# EAGLE design pro_event_light_a_mkI_base_board (EAGLE 7.7.0)

## Sheet 1 of 3: Spannungsversorgung
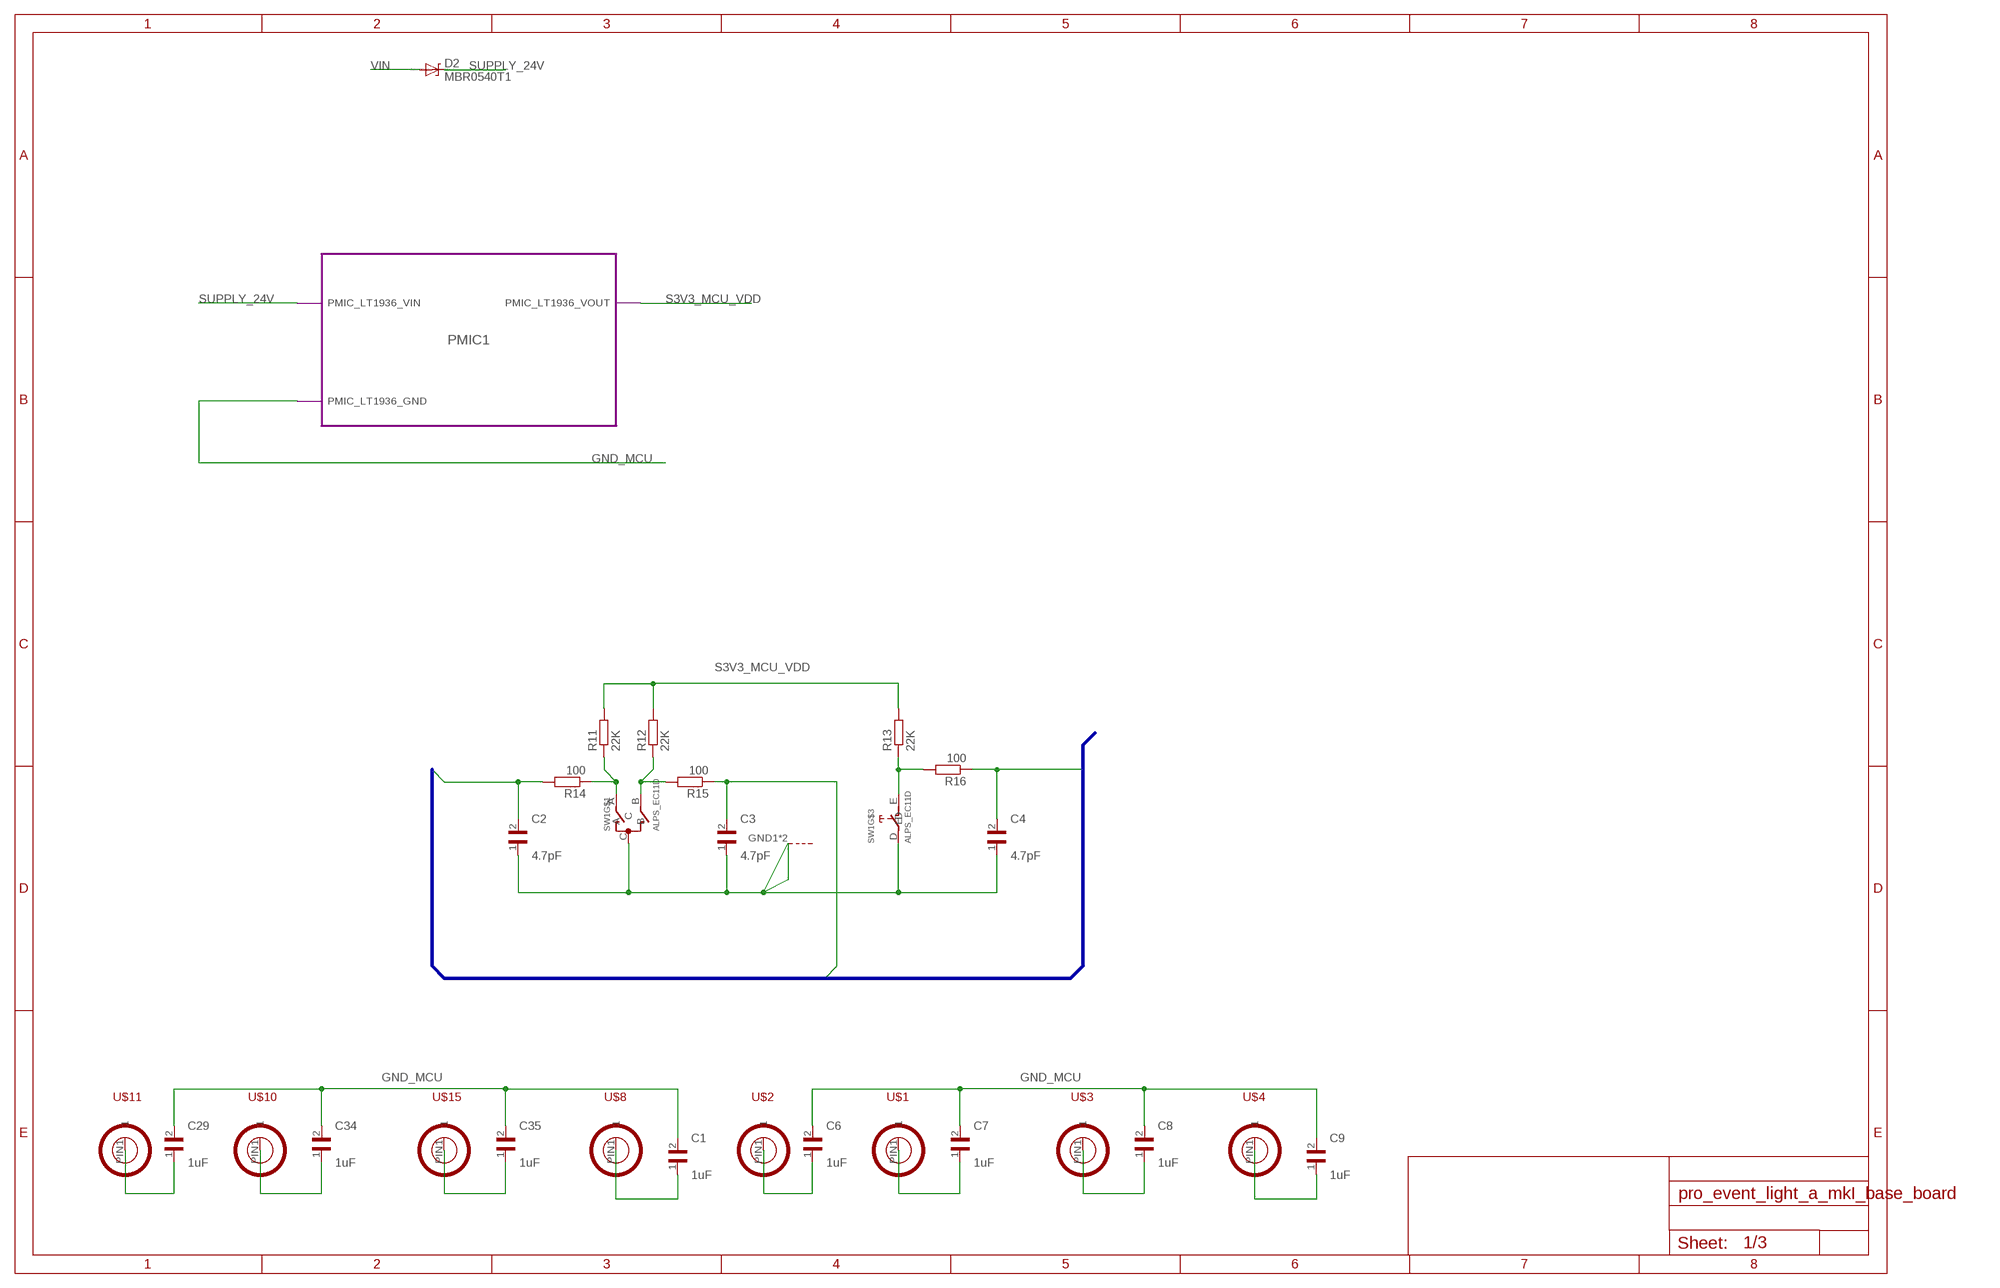
[diagram p0: schematic, sheet 1]

### Parts
C1  1uF  WCAP-CSGP_1206  [WCAP-CSGP_1206]
C2  4.7pF  WCAP-CSGP_0603-WAVE  [WCAP-CSGP_0603_WAVE]
C3  4.7pF  WCAP-CSGP_0603-WAVE  [WCAP-CSGP_0603_WAVE]
C4  4.7pF  WCAP-CSGP_0603-WAVE  [WCAP-CSGP_0603_WAVE]
C6  1uF  WCAP-CSGP_1206  [WCAP-CSGP_1206]
C7  1uF  WCAP-CSGP_1206  [WCAP-CSGP_1206]
C8  1uF  WCAP-CSGP_1206  [WCAP-CSGP_1206]
C9  1uF  WCAP-CSGP_1206  [WCAP-CSGP_1206]
C29  1uF  WCAP-CSGP_1206  [WCAP-CSGP_1206]
C34  1uF  WCAP-CSGP_1206  [WCAP-CSGP_1206]
C35  1uF  WCAP-CSGP_1206  [WCAP-CSGP_1206]
D2  MBR0540T1  [SOD123]
R11  22K  R-EU_R0603  [R0603]
R12  22K  R-EU_R0603  [R0603]
R13  22K  R-EU_R0603  [R0603]
R14  100  R-EU_R0603  [R0603]
R15  100  R-EU_R0603  [R0603]
R16  100  R-EU_R0603  [R0603]
SW1  ALPS_EC11D  [ALPS_EC11D]
U$1  PCB_MOUNTING_HOLES_M3  [PCB_MOUNTING_HOLES_M3]
U$2  PCB_MOUNTING_HOLES_M3  [PCB_MOUNTING_HOLES_M3]
U$3  PCB_MOUNTING_HOLES_M3  [PCB_MOUNTING_HOLES_M3]
U$4  PCB_MOUNTING_HOLES_M3  [PCB_MOUNTING_HOLES_M3]
U$8  PCB_MOUNTING_HOLES_M3  [PCB_MOUNTING_HOLES_M3]
U$10  PCB_MOUNTING_HOLES_M3  [PCB_MOUNTING_HOLES_M3]
U$11  PCB_MOUNTING_HOLES_M3  [PCB_MOUNTING_HOLES_M3]
U$15  PCB_MOUNTING_HOLES_M3  [PCB_MOUNTING_HOLES_M3]

### Module instances
PMIC1 = PMIC_LT1936

### Nets
ENCODER_A: C2.2 R14.2 ; also sheet 2
ENCODER_B: C3.2 R15.1 ; also sheet 2
ENCODER_D: C4.2 R16.1 ; also sheet 2
GND_MCU [MCU_Ground]: C1.2 C2.1 C3.1 C4.1 C6.2 C7.2 C8.2 C9.2 C29.2 C34.2 C35.2 SW1.C SW1.D SW1.GND1(G) SW1.GND2(G) ; port PMIC1.PMIC_LT1936_GND ; also sheet 2,3
N$1: R11.1 R14.1 SW1.A
N$2: R12.1 R15.2 SW1.B
N$5: C6.1 U$2.PIN1
N$8: C7.1 U$1.PIN1
N$9: C29.1 U$11.PIN1
N$10: C8.1 U$3.PIN1
N$11: C9.1 U$4.PIN1
N$15: C34.1 U$10.PIN1
N$16: R13.1 R16.2 SW1.E
N$17: C35.1 U$15.PIN1
N$18: C1.1 U$8.PIN1
S3V3_MCU_VDD: R11.2 R12.2 R13.2 ; port PMIC1.PMIC_LT1936_VOUT ; also sheet 2
SUPPLY_24V [MCU_Power]: D2.C ; port PMIC1.PMIC_LT1936_VIN ; also sheet 3
VIN: D2.A

### Buses
ENCODER_BUS:ENCODER_A,ENCODER_B,ENCODER_D

## Sheet 2 of 3: Mikrocontroller
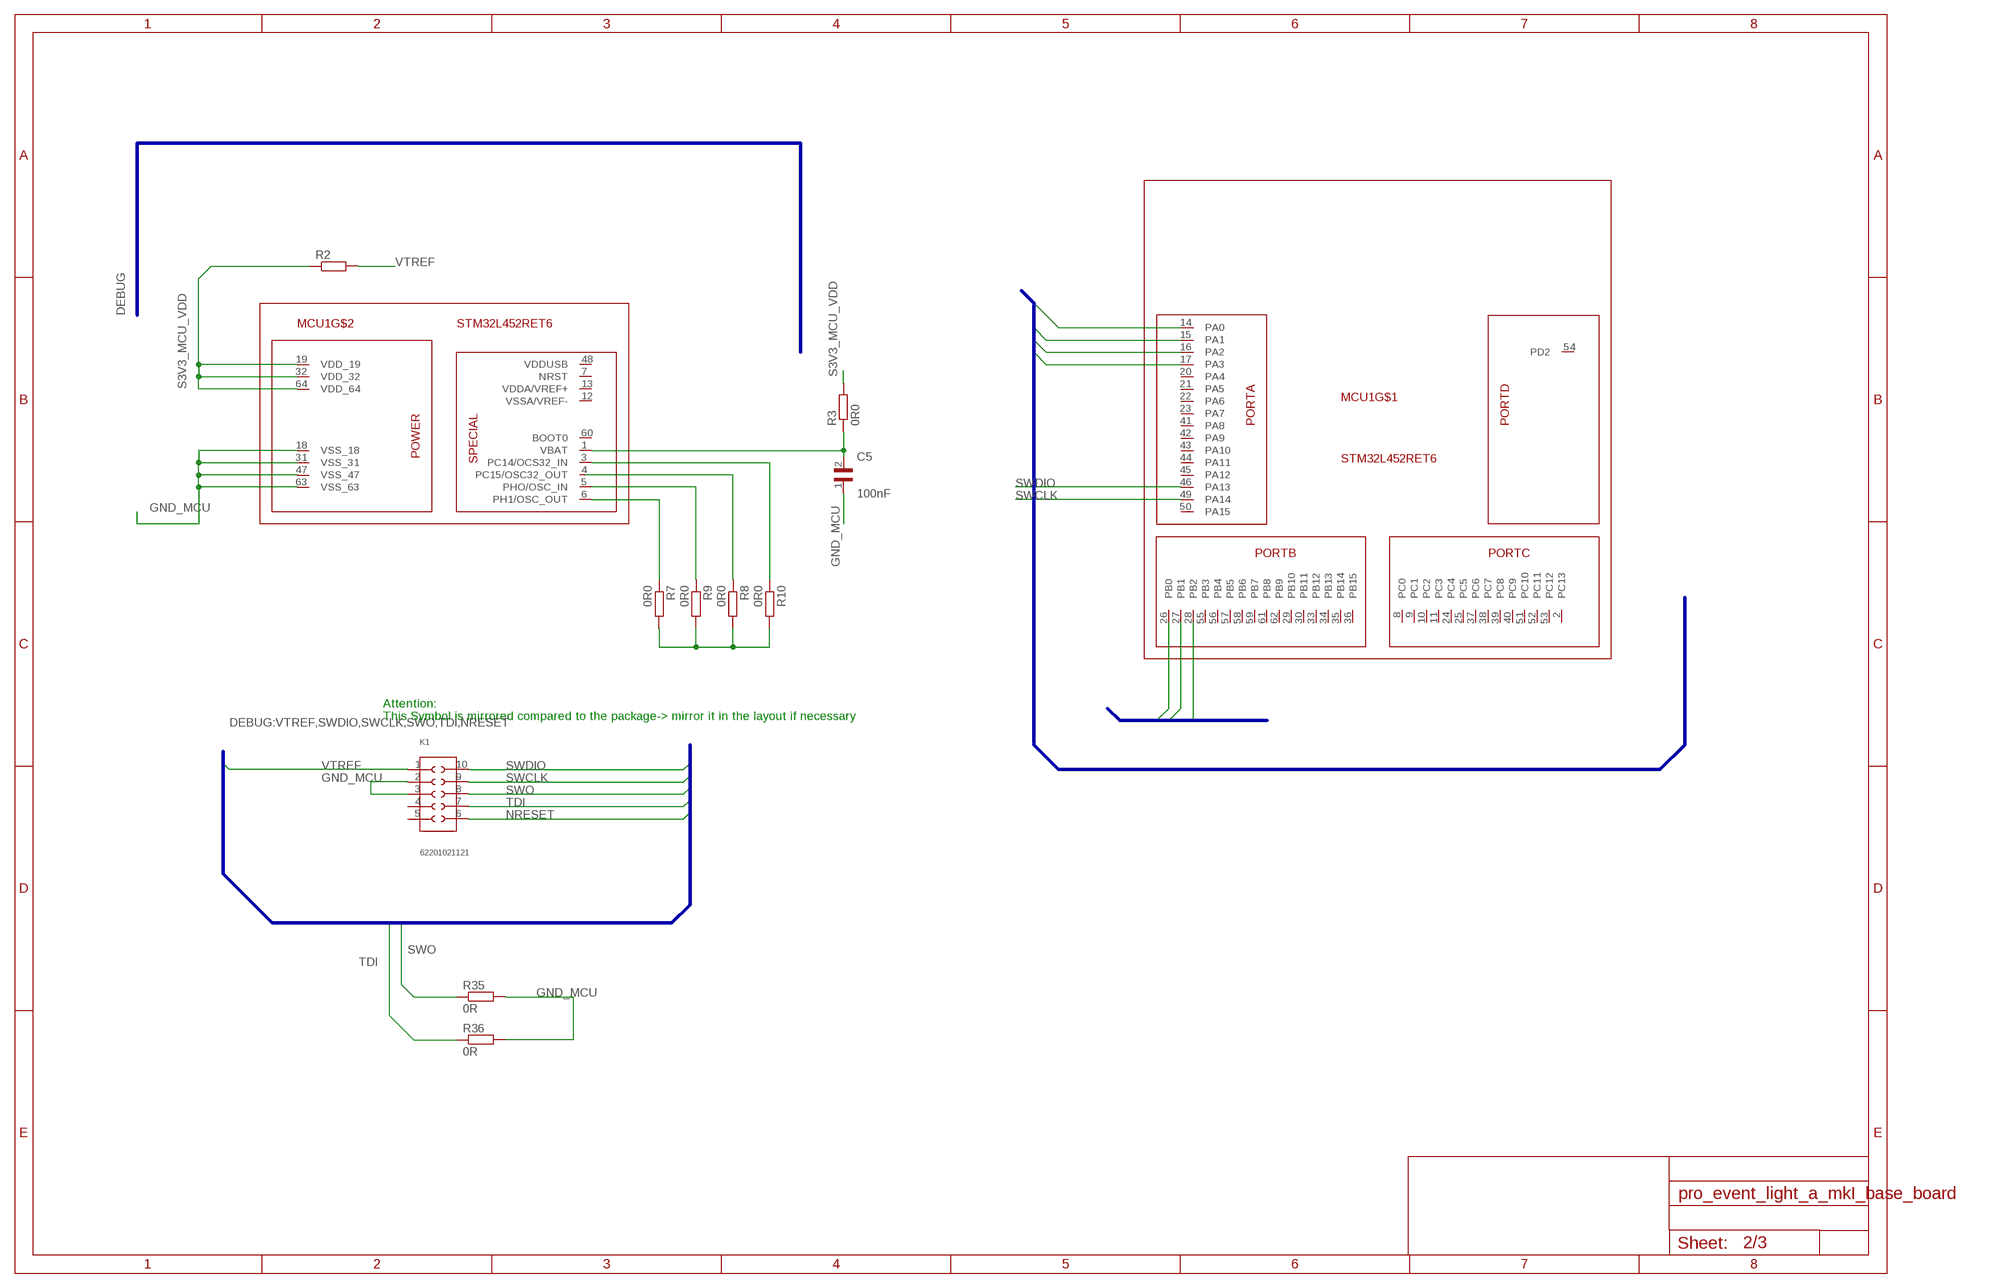
[diagram p1: schematic, sheet 2]

### Parts
C5  100nF  WCAP-CSGP_0603-REFLOW  [WCAP-CSGP_0603_REFLOW]
K1  62201021121  [62201021121]
MCU1  STM32L452RET6  [LQFP64]
R2  R-EU_R0603  [R0603]
R3  0R0  R-EU_R0603  [R0603]
R7  0R0  R-EU_R0603  [R0603]
R8  0R0  R-EU_R0603  [R0603]
R9  0R0  R-EU_R0603  [R0603]
R10  0R0  R-EU_R0603  [R0603]
R35  0R  R-EU_R0603  [R0603]
R36  0R  R-EU_R0603  [R0603]

### Nets
ENCODER_A: MCU1.26(PB0) ; also sheet 1
ENCODER_B: MCU1.27(PB1) ; also sheet 1
ENCODER_D: MCU1.28(PB2) ; also sheet 1
GND_MCU [MCU_Ground]: C5.1 K1.2 K1.3 MCU1.18(VSS_18) MCU1.47(VSS_47) MCU1.63(VSS_63) R7.2 R8.2 R9.2 R10.2 R35.2 R36.2 ; also sheet 1,3
LEDB: MCU1.15(PA1) ; also sheet 3
LEDG: MCU1.14(PA0) ; also sheet 3
LEDR: MCU1.16(PA2) ; also sheet 3
LEDW: MCU1.17(PA3) ; also sheet 3
N$19: C5.2 MCU1.1(VBAT) R3.1
N$20: MCU1.3(PC14/OCS32_IN) R10.1
N$21: R8.1
N$26: MCU1.5(PHO/OSC_IN) R9.1
N$27: MCU1.6(PH1/OSC_OUT) R7.1
NRESET [Debug]: K1.6
S3V3_MCU_VDD: MCU1.19(VDD_19) MCU1.32(VDD_32) MCU1.64(VDD_64) R2.1 R3.2 ; also sheet 1
SWCLK [Debug]: K1.9 MCU1.49(PA14)
SWDIO [Debug]: K1.10 MCU1.46(PA13)
SWO [Debug]: K1.8 R35.1
TDI [Debug]: K1.7 R36.1
VTREF [Debug]: K1.1 R2.2
Unconnected: K1.4 K1.5 MCU1.2(PC13) MCU1.4(PC15/OSC32_OUT) MCU1.7(NRST) MCU1.8(PC0) MCU1.9(PC1) MCU1.10(PC2) MCU1.11(PC3) MCU1.12(VSSA/VREF-) MCU1.13(VDDA/VREF+) MCU1.20(PA4) MCU1.21(PA5) MCU1.22(PA6) MCU1.23(PA7) MCU1.24(PC4) MCU1.25(PC5) MCU1.29(PB10) MCU1.30(PB11) MCU1.31(VSS_31) MCU1.33(PB12) MCU1.34(PB13) MCU1.35(PB14) MCU1.36(PB15) MCU1.37(PC6) MCU1.38(PC7) MCU1.39(PC8) MCU1.40(PC9) MCU1.41(PA8) MCU1.42(PA9) MCU1.43(PA10) MCU1.44(PA11) MCU1.45(PA12) MCU1.48(VDDUSB) MCU1.50(PA15) MCU1.51(PC10) MCU1.52(PC11) MCU1.53(PC12) MCU1.54(PD2) MCU1.55(PB3) MCU1.56(PB4) MCU1.57(PB5) MCU1.58(PB6) MCU1.59(PB7) MCU1.60(BOOT0) MCU1.61(PB8) MCU1.62(PB9)

### Buses
DEBUG:VTREF,SWDIO,SWCLK,SWO,TDI,NRESET
DEBUG
LEDBUS:LEDG,LEDB,LEDR,LEDW
ENCODER_BUS:ENCODER_A,ENCODER_B,ENCODER_D

### Notes on the sheet
- Attention:
  This Symbol is mirrored compared to the package-> mirror it in the layout if necessary

## Sheet 3 of 3: LED Power
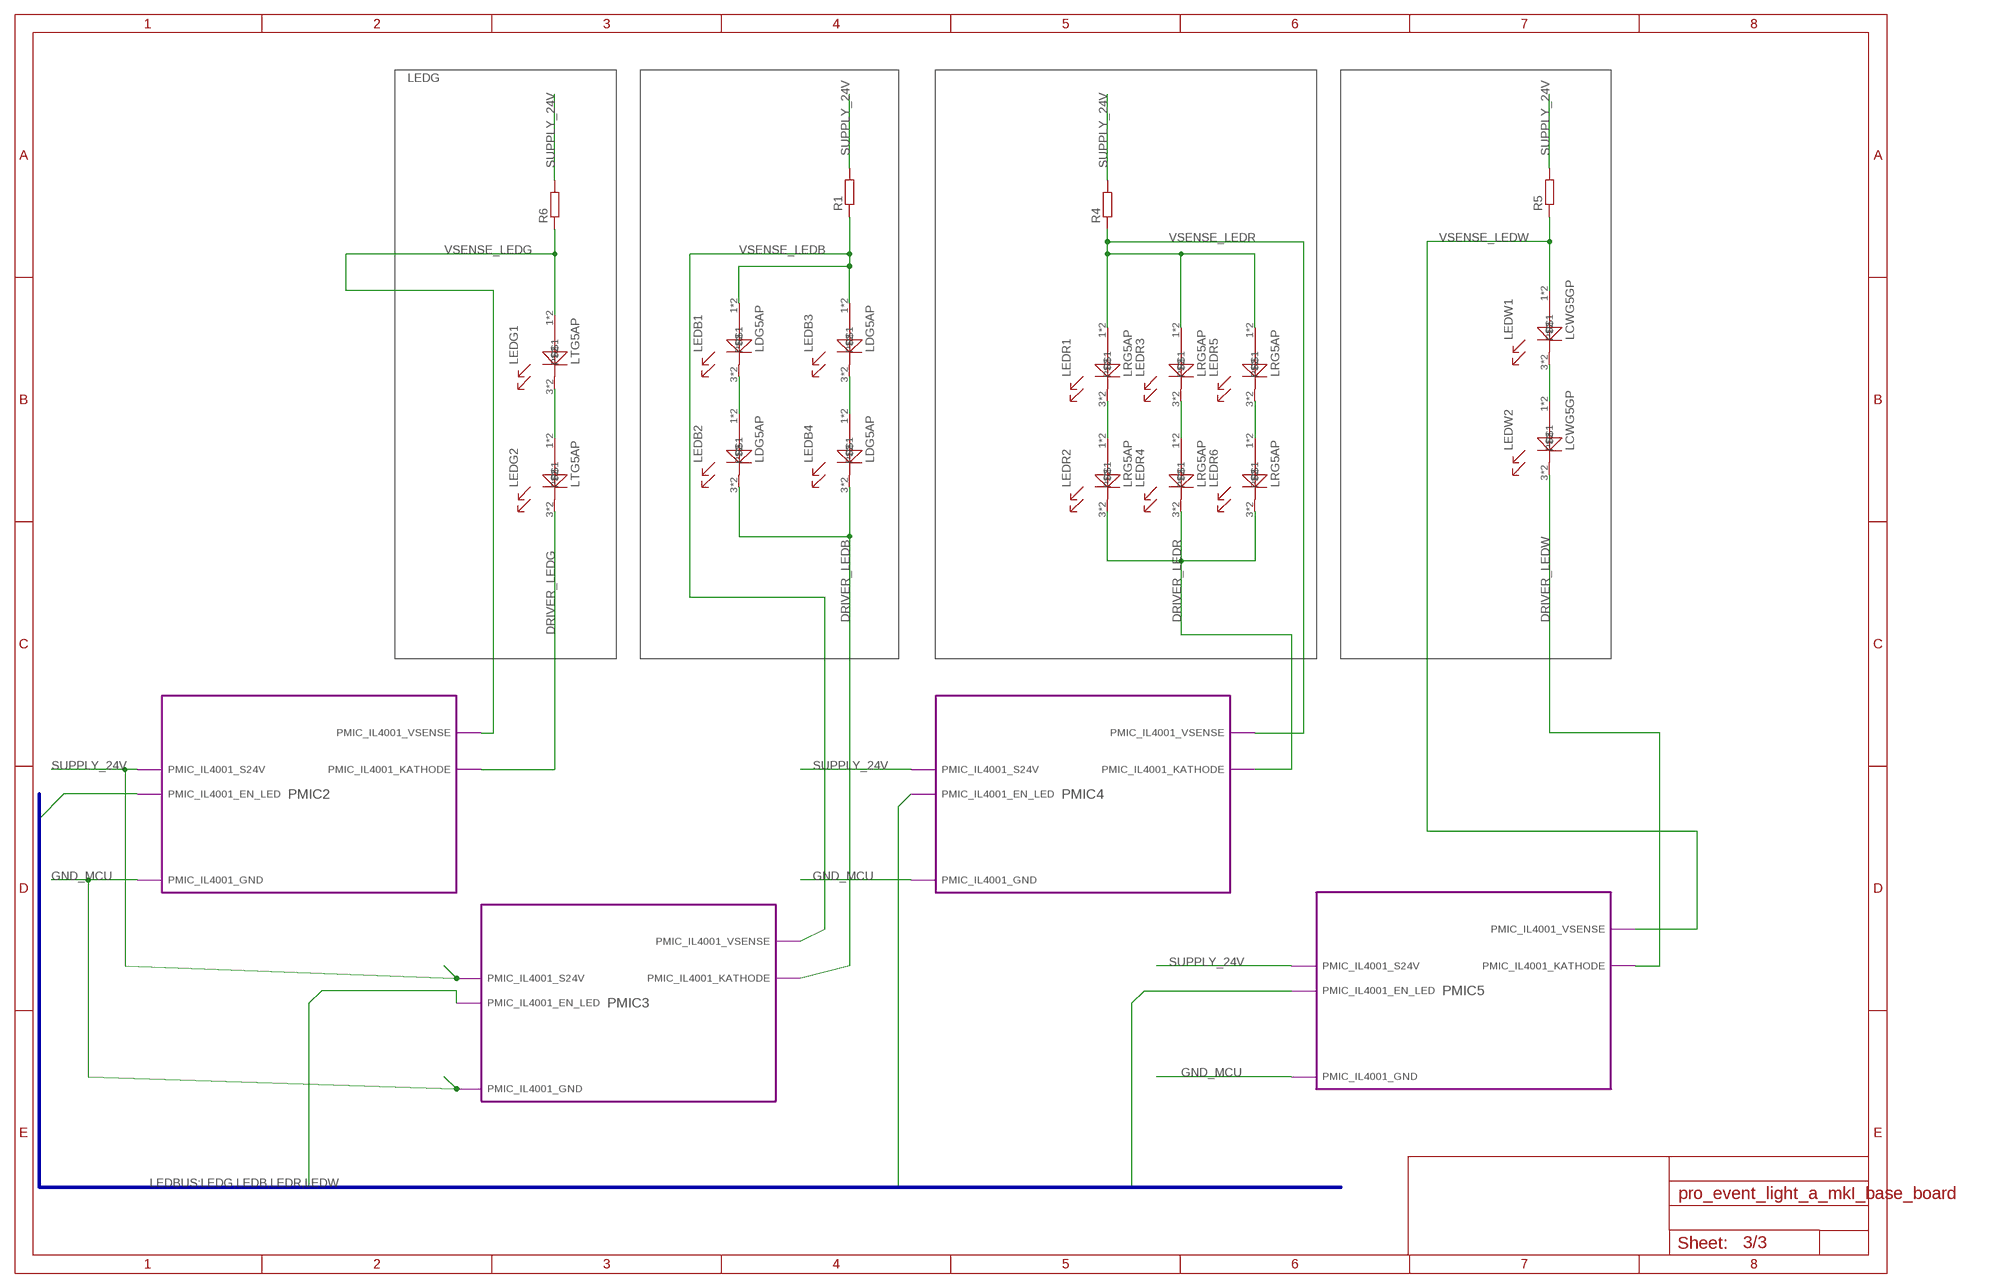
[diagram p2: schematic, sheet 3]

### Parts
LEDB1  LDG5AP  [P-LCC-2]
LEDB2  LDG5AP  [P-LCC-2]
LEDB3  LDG5AP  [P-LCC-2]
LEDB4  LDG5AP  [P-LCC-2]
LEDG1  LTG5AP  [P-LCC-2]
LEDG2  LTG5AP  [P-LCC-2]
LEDR1  LRG5AP  [P-LCC-2]
LEDR2  LRG5AP  [P-LCC-2]
LEDR3  LRG5AP  [P-LCC-2]
LEDR4  LRG5AP  [P-LCC-2]
LEDR5  LRG5AP  [P-LCC-2]
LEDR6  LRG5AP  [P-LCC-2]
LEDW1  LCWG5GP  [P-LCC-2]
LEDW2  LCWG5GP  [P-LCC-2]
R1  R-EU_R0603  [R0603]
R4  R-EU_R0603  [R0603]
R5  R-EU_R0603  [R0603]
R6  R-EU_R0603  [R0603]

### Module instances
PMIC2 = PMIC_IL4001
PMIC4 = PMIC_IL4001
PMIC5 = PMIC_IL4001
PMIC3 = PMIC_IL4001

### Nets
DRIVER_LEDB: LEDB2.3 LEDB2.4 LEDB4.3 LEDB4.4 ; port PMIC3.PMIC_IL4001_KATHODE
DRIVER_LEDG: LEDG2.3 LEDG2.4 ; port PMIC2.PMIC_IL4001_KATHODE
DRIVER_LEDR: LEDR2.3 LEDR2.4 LEDR4.3 LEDR4.4 LEDR6.3 LEDR6.4 ; port PMIC4.PMIC_IL4001_KATHODE
DRIVER_LEDW: LEDW2.3 LEDW2.4 ; port PMIC5.PMIC_IL4001_KATHODE
GND_MCU [MCU_Ground]: port PMIC2.PMIC_IL4001_GND PMIC3.PMIC_IL4001_GND PMIC5.PMIC_IL4001_GND PMIC4.PMIC_IL4001_GND ; also sheet 1,2
LEDB: port PMIC3.PMIC_IL4001_EN_LED ; also sheet 2
LEDG: port PMIC2.PMIC_IL4001_EN_LED ; also sheet 2
LEDR: port PMIC4.PMIC_IL4001_EN_LED ; also sheet 2
LEDW: port PMIC5.PMIC_IL4001_EN_LED ; also sheet 2
N$3: LEDG1.3 LEDG1.4 LEDG2.1 LEDG2.2
N$4: LEDB1.3 LEDB1.4 LEDB2.1 LEDB2.2
N$6: LEDB3.3 LEDB3.4 LEDB4.1 LEDB4.2
N$7: LEDR1.3 LEDR1.4 LEDR2.1 LEDR2.2
N$12: LEDR3.3 LEDR3.4 LEDR4.1 LEDR4.2
N$14: LEDR5.3 LEDR5.4 LEDR6.1 LEDR6.2
N$25: LEDW1.3 LEDW1.4 LEDW2.1 LEDW2.2
SUPPLY_24V [MCU_Power]: R1.2 R4.2 R5.2 R6.2 ; port PMIC2.PMIC_IL4001_S24V PMIC3.PMIC_IL4001_S24V PMIC5.PMIC_IL4001_S24V PMIC4.PMIC_IL4001_S24V ; also sheet 1
VSENSE_LEDB: LEDB1.1 LEDB1.2 LEDB3.1 LEDB3.2 R1.1 ; port PMIC3.PMIC_IL4001_VSENSE
VSENSE_LEDG: LEDG1.1 LEDG1.2 R6.1 ; port PMIC2.PMIC_IL4001_VSENSE
VSENSE_LEDR: LEDR1.1 LEDR1.2 LEDR3.1 LEDR3.2 LEDR5.1 LEDR5.2 R4.1 ; port PMIC4.PMIC_IL4001_VSENSE
VSENSE_LEDW: LEDW1.1 LEDW1.2 R5.1 ; port PMIC5.PMIC_IL4001_VSENSE

### Buses
LEDBUS:LEDG,LEDB,LEDR,LEDW

### Notes on the sheet
- LEDG

## Library data of the parts
C1-C9 C29 C34 C35 = Eagle_Wurth_Elektronik_Passive_Capacitors_rev15a:WCAP-CSGP: WCAP-CSGP Ceramic Capacitors Characteristics Multilayer Ceramic Chip Capacitor Recommended soldering:Reflow, for 0603 and 0805 wave soldering is also allowed Operating temperature:-55 °C to +125 °C; Ceramic characteristics: Class I - NPO ; Class II -X7R, X5R High performance ceramic High capacitance stability Minimal aging Termination:Cu/Ni/Sn <http://katalog.we-online.de/media/images/eisos/WCAP-CSGP_pf2.jpg> Details see: http://katalog.we-online.de/en/pbs/WCAP-CSGP/?m Created: 2015-01-28 2015 (C) Wurth Elektronik
D2 = mod_eagle_library_discrete_elements:MBR0540T1: MBR0540T1
K1 = Board_to_Board_Connectors_rev15d:62201021121: WR-PHD 1.27mm Dual Pin Header, 10 Pins=>Code : Con_BTB_PHD_1.27_2_62201021121 <http://katalog.we-online.de/media/thumbs2/eican/thb_Con_BTB_PHD_1.27_2_6220xx21121_pf2.jpg> Details see: http://katalog.we-online.de/en/em/622_0xx_211_21 Created 2014-06-03, Karrer Zheng 2014 (C) Würth Elektronik
LEDB1-LEDB4 = mod_eagle_library_discrete_elements:LDG5AP: OSRAM Advanced Power TOPLED LDG5AP deep blue
LEDG1 LEDG2 = mod_eagle_library_discrete_elements:LTG5AP: OSRAM Advanced Power TOPLED LTG5AP true green
LEDR1-LEDR6 = mod_eagle_library_discrete_elements:LRG5AP: OSRAM Advanced Power TOPLED LRG5AP single color red
LEDW1 LEDW2 = mod_eagle_library_discrete_elements:LCWG5GP: OSRAM Advanced Power TOPLED LCWG5GP warm white
MCU1 = mod_eagle_library_MCU_CPU:STM32L452RET6: STM32L452RET6
R1-R16 R35 R36 = rcl:R-EU_: RESISTOR, European symbol
SW1 = mod_eagle_library_switches:ALPS_EC11D: ALPS EC11D rotary switch
U$1-U$4 U$8 U$10 U$11 U$15 = mod-eagle_library_standard_passive_parts:PCB_MOUNTING_HOLES_M3

## Module PMIC_IL4001
Ports: PMIC_IL4001_S24V(io) PMIC_IL4001_EN_LED(io) PMIC_IL4001_GND(io) PMIC_IL4001_KATHODE(io) PMIC_IL4001_VSENSE(io)
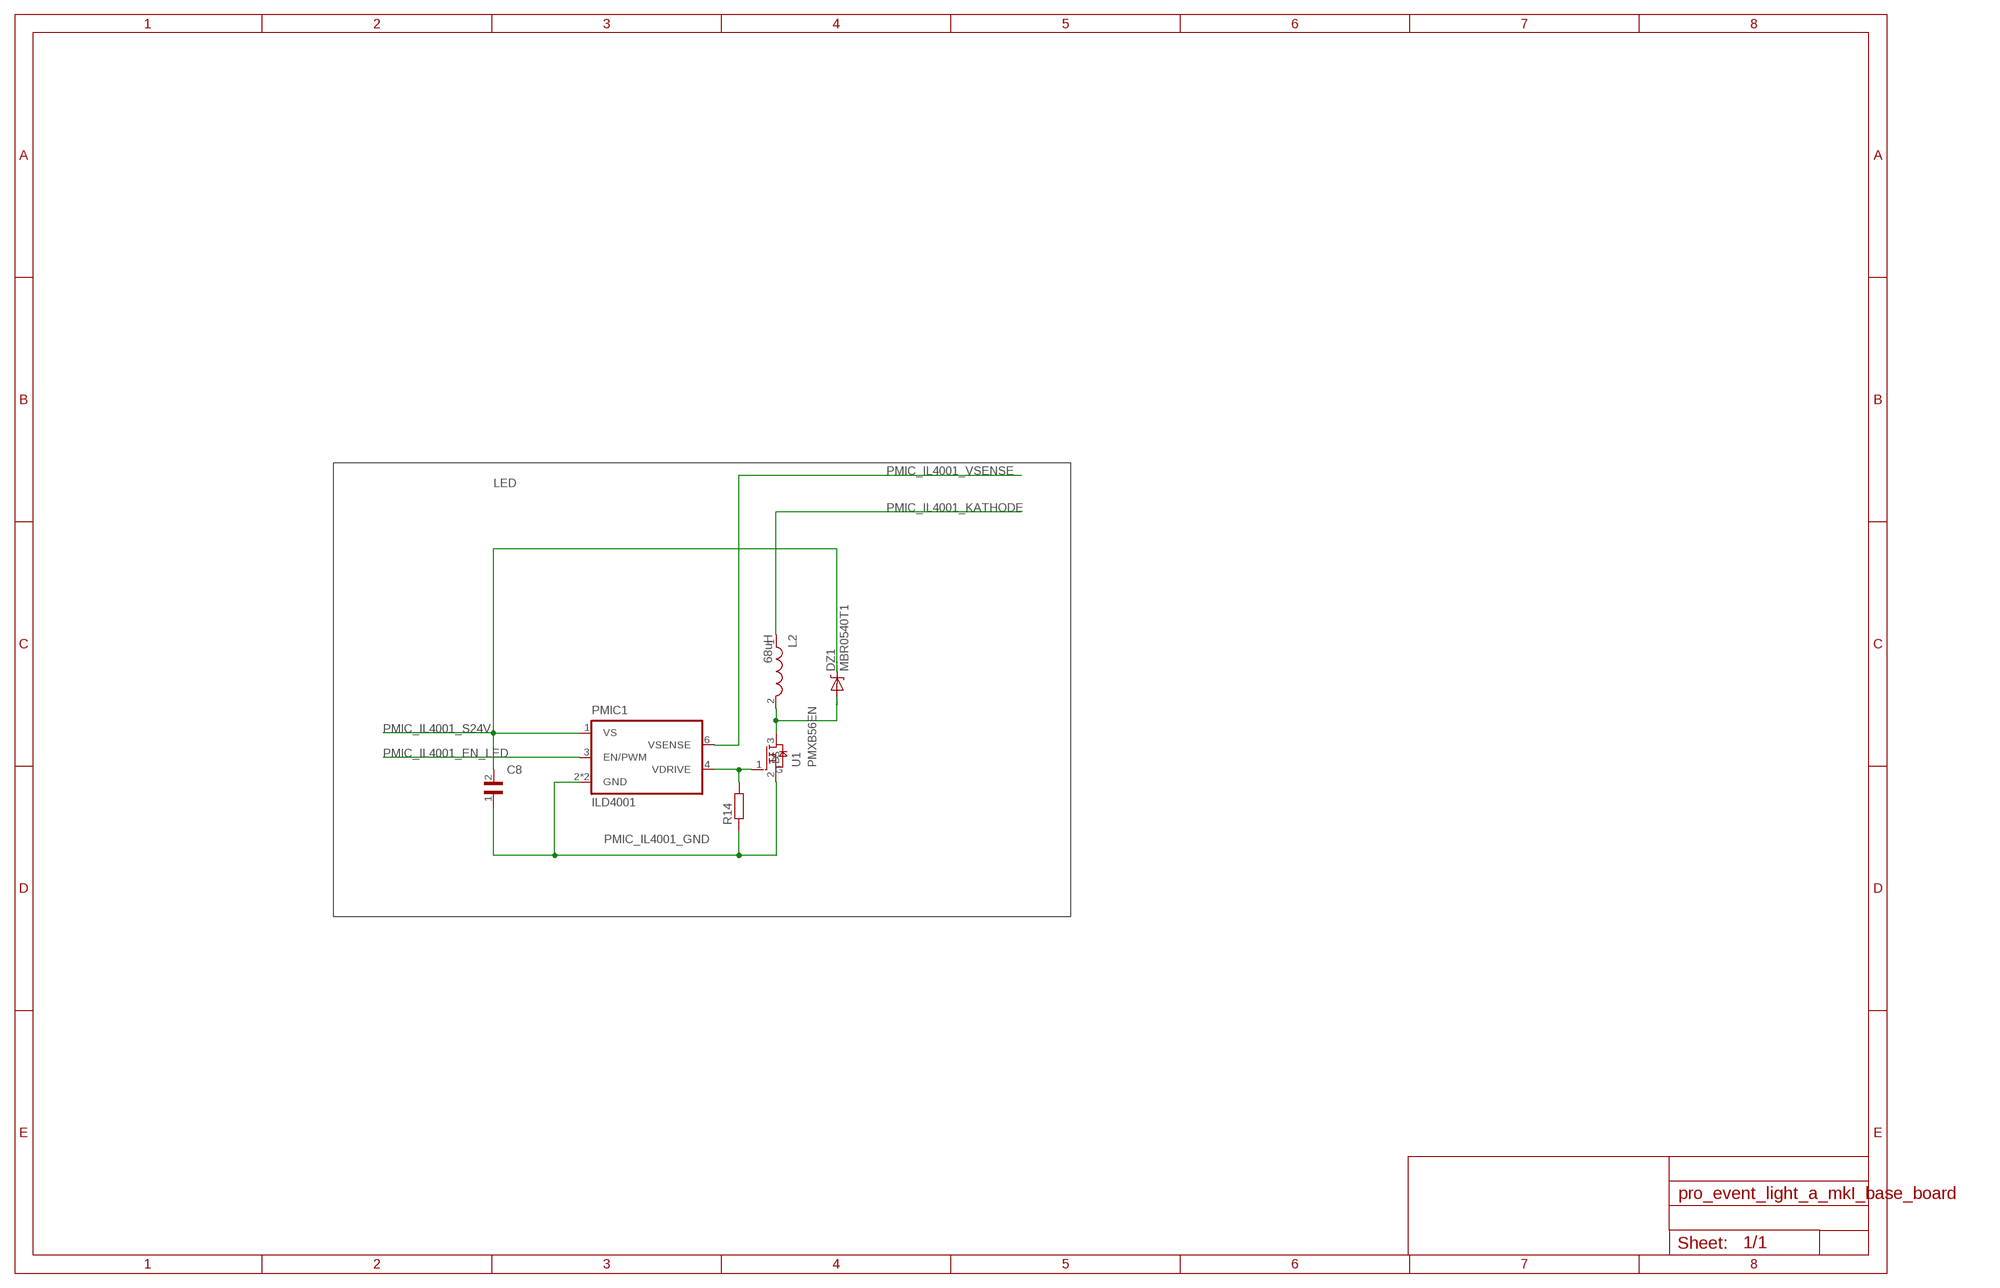
[diagram p3: schematic, module PMIC_IL4001, sheet 1]

### Parts
C8  WCAP-CSGP_0603-WAVE  [WCAP-CSGP_0603_WAVE]
DZ1  MBR0540T1  [SOD123]
L2  68uH  WE-LQ_1210  [WE-LQ_M]
PMIC1  ILD4001  [SC74_INFINEON]
R14  R-EU_R0603  [R0603]
U1  PMXB56EN  [DFN1010D-3]

### Nets
N$2: PMIC1.4(VDRIVE) R14.2 U1.1(G)
N$29: DZ1.A L2.2 U1.3(D)
PMIC_IL4001_EN_LED: PMIC1.3(EN/PWM)
PMIC_IL4001_GND [MCU_Ground]: C8.1 PMIC1.2(GND) PMIC1.5(GND) R14.1 U1.2(S)
PMIC_IL4001_KATHODE: L2.1
PMIC_IL4001_S24V: C8.2 DZ1.C PMIC1.1(VS)
PMIC_IL4001_VSENSE: PMIC1.6(VSENSE)

### Notes on the sheet
- LED

### Library data of the parts
C8 = Eagle_Wurth_Elektronik_Passive_Capacitors_rev15a:WCAP-CSGP: WCAP-CSGP Ceramic Capacitors Characteristics Multilayer Ceramic Chip Capacitor Recommended soldering:Reflow, for 0603 and 0805 wave soldering is also allowed Operating temperature:-55 °C to +125 °C; Ceramic characteristics: Class I - NPO ; Class II -X7R, X5R High performance ceramic High capacitance stability Minimal aging Termination:Cu/Ni/Sn <http://katalog.we-online.de/media/images/eisos/WCAP-CSGP_pf2.jpg> Details see: http://katalog.we-online.de/en/pbs/WCAP-CSGP/?m Created: 2015-01-28 2015 (C) Wurth Elektronik
DZ1 = mod_eagle_library_discrete_elements:MBR0540T1: MBR0540T1
L2 = EagleLibrary_Wuerth_Elektronik_eiSos_rev16a:WE-LQ: SMD Inductor Characteristics Miniature chip inductor wound on a special ferrite core Small inductances for compact circuits High Q at high frequencies Low DC-resistance Operating temperature: –40 ºC to +125 ºC Applications Low power DC/DC-converters from Linear Technology, National Semiconductor, Texas Instruments, Fairchild Semiconductor, ON Semiconductor, STMicroelectronics, Maxim, MPS, Semtech, Exar, Analogic Tech, Diodes and Cologne Chip EMI-Filtering RF-circuits <http://katalog.we-online.de/media/images/eisos/IndLQ_pf2.jpg> Details see: http://katalog.we-online.de/en/pbs/WE-LQ? Updated by Dan Xu 2014-07-08 2014 (C) Wurth Elektronik
PMIC1 = infineon:ILD4001: LED Driver for High Power LEDs Source: http://www.infineon.com/dgdl/ILD4001-Step-down-LED-Controller-Rev2.0.pdf?folderId=db3a30431f848401011fcbf2ab4c04c4&fileId=db3a30433072cd8f01308fc1af03786b
R14 = rcl:R-EU_: RESISTOR, European symbol
U1 = mod_eagle_library_discrete_elements:PMXB56EN

## Module PMIC_LT1936
Ports: PMIC_LT1936_VIN(io) PMIC_LT1936_VOUT(io) PMIC_LT1936_GND(io)
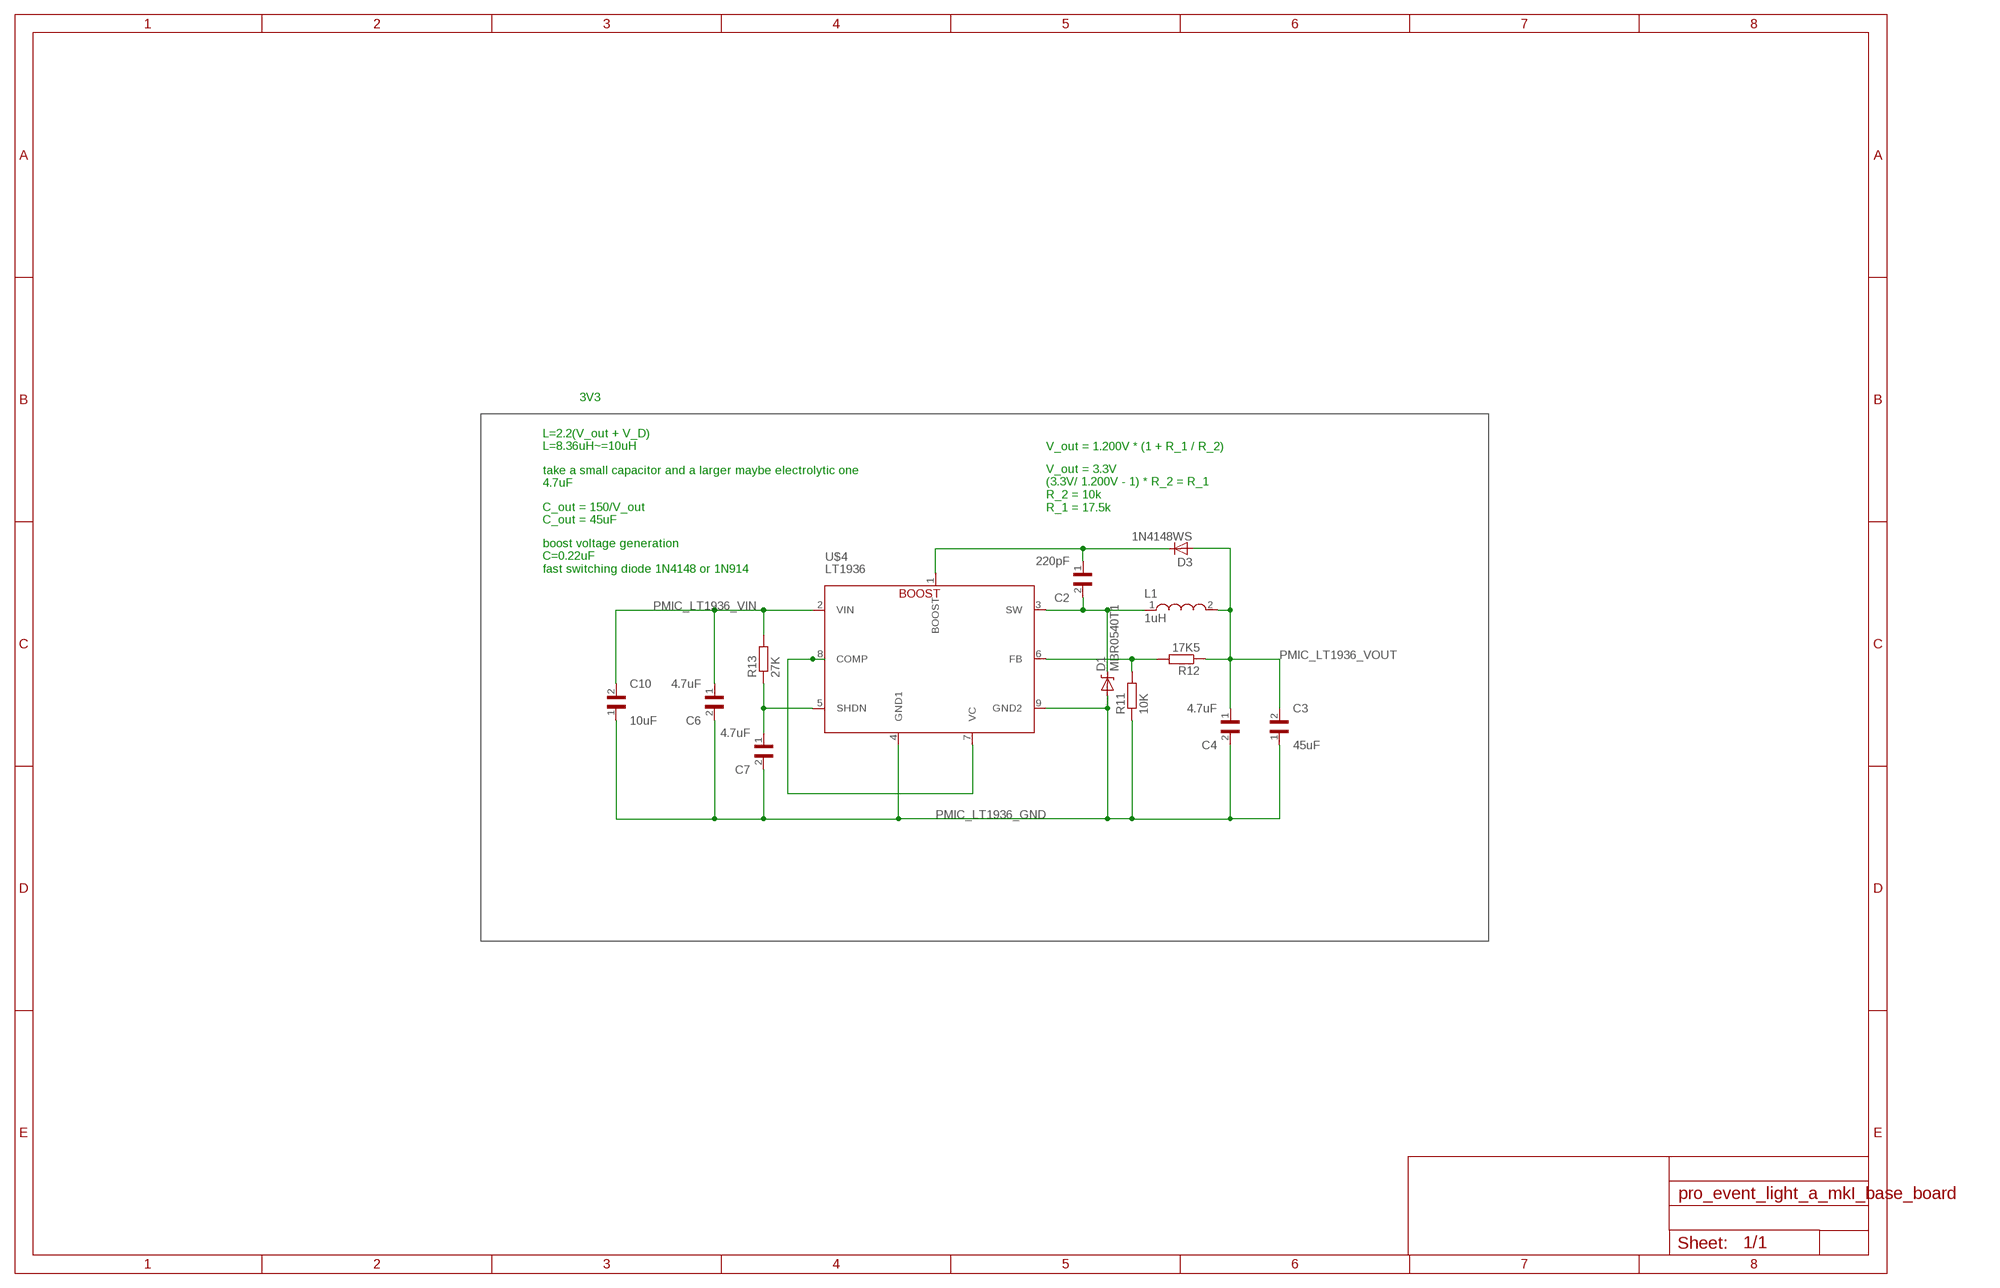
[diagram p4: schematic, module PMIC_LT1936, sheet 1]

### Parts
C2  220pF  WCAP-CSGP_0603-WAVE  [WCAP-CSGP_0603_WAVE]
C3  45uF  WCAP-ASNP_4X5.5(DXL)  [2.6X1.6X1(BXCXA)]
C4  4.7uF  WCAP-CSGP_0603-WAVE  [WCAP-CSGP_0603_WAVE]
C6  4.7uF  WCAP-CSGP_0603-WAVE  [WCAP-CSGP_0603_WAVE]
C7  4.7uF  WCAP-CSGP_0603-WAVE  [WCAP-CSGP_0603_WAVE]
C10  10uF  WCAP-ASNP_4X5.5(DXL)  [2.6X1.6X1(BXCXA)]
D1  MBR0540T1  [SOD123]
D3  1N4148WS  [SOD323]
L1  1uH  WE-LQ_1210  [WE-LQ_M]
R11  10K  R-EU_R0603  [R0603]
R12  17K5  R-EU_R0603  [R0603]
R13  27K  R-EU_R0603  [R0603]
U$4  LT1936  [MSOP8]

### Nets
N$28: U$4.7(VC) U$4.8(COMP)
N$30: C7.1 R13.1 U$4.5(SHDN)
N$35: R11.2 R12.2 U$4.6(FB)
PMIC_LT1936_BOOST: C2.1 D3.C U$4.1(BOOST)
PMIC_LT1936_GND [MCU_Ground]: C3.1 C4.2 C6.2 C7.2 C10.1 D1.A R11.1 U$4.4(GND1) U$4.9(GND2)
PMIC_LT1936_SW: C2.2 D1.C L1.1 U$4.3(SW)
PMIC_LT1936_VIN: C6.1 C10.2 R13.2 U$4.2(VIN)
PMIC_LT1936_VOUT: C3.2 C4.1 D3.A L1.2 R12.1

### Notes on the sheet
- 3V3
- L=2.2(V_out + V_D)
  L=8.36uH~=10uH
- V_out = 1.200V * (1 + R_1 / R_2)
- take a small capacitor and a larger maybe electrolytic one
  4.7uF
- V_out = 3.3V
  (3.3V/ 1.200V - 1) * R_2 = R_1
  R_2 = 10k
  R_1 = 17.5k
- C_out = 150/V_out
  C_out = 45uF
- boost voltage generation
  C=0.22uF
  fast switching diode 1N4148 or 1N914

### Library data of the parts
C2 C4 C6 C7 = Eagle_Wurth_Elektronik_Passive_Capacitors_rev15a:WCAP-CSGP: WCAP-CSGP Ceramic Capacitors Characteristics Multilayer Ceramic Chip Capacitor Recommended soldering:Reflow, for 0603 and 0805 wave soldering is also allowed Operating temperature:-55 °C to +125 °C; Ceramic characteristics: Class I - NPO ; Class II -X7R, X5R High performance ceramic High capacitance stability Minimal aging Termination:Cu/Ni/Sn <http://katalog.we-online.de/media/images/eisos/WCAP-CSGP_pf2.jpg> Details see: http://katalog.we-online.de/en/pbs/WCAP-CSGP/?m Created: 2015-01-28 2015 (C) Wurth Elektronik
C3 C10 = Eagle_Wurth_Elektronik_Passive_Capacitors_rev15a:WCAP-ASNP: WCAP-ASNP Aluminum Electrolytic Capacitors Characteristics Aluminum Electrolytic Capacitor Recommended soldering: Reflow Operating temperature: -40 °C to +85 °C Non-polarized product series with +85 °C max temperature Load life:2000 h @ +85 °C Package name and Variant abbreviation: Package: Package: B X C X A = length of the solder pad X width of the solder pad X pitch of the solder pad. Variant: D X L = Diameter of the body part X Height of the body part. <http://katalog.we-online.de/media/images/eisos/WCAP-ASNP_pf2.jpg> Details see: http://katalog.we-online.de/en/pbs/WCAP-ASNP?m Created: 2015-03-10 2015 (C) Wurth Elektronik
D1 = mod_eagle_library_discrete_elements:MBR0540T1: MBR0540T1
D3 = mod_eagle_library_discrete_elements:1N4148WS: 1N4148WS <https://www.vishay.com/diodes/list/product-85413>
L1 = EagleLibrary_Wuerth_Elektronik_eiSos_rev16a:WE-LQ: SMD Inductor Characteristics Miniature chip inductor wound on a special ferrite core Small inductances for compact circuits High Q at high frequencies Low DC-resistance Operating temperature: –40 ºC to +125 ºC Applications Low power DC/DC-converters from Linear Technology, National Semiconductor, Texas Instruments, Fairchild Semiconductor, ON Semiconductor, STMicroelectronics, Maxim, MPS, Semtech, Exar, Analogic Tech, Diodes and Cologne Chip EMI-Filtering RF-circuits <http://katalog.we-online.de/media/images/eisos/IndLQ_pf2.jpg> Details see: http://katalog.we-online.de/en/pbs/WE-LQ? Updated by Dan Xu 2014-07-08 2014 (C) Wurth Elektronik
R11-R13 = rcl:R-EU_: RESISTOR, European symbol
U$4 = mod_eagle_library_pmic:LT1936

## Net classes
4 MCU_Power: width 0.203 mm, clearance 0.152 mm to class 0, clearance 0.152 mm to class 1, clearance 0.152 mm to class 2, clearance 0.152 mm to class 3, clearance 0.152 mm
5 Debug: width 0.152 mm, drill 0.305 mm, clearance 0.152 mm to class 0, clearance 0.152 mm to class 1, clearance 0.152 mm to class 2, clearance 0.152 mm to class 3, clearance 0.152 mm to class 4, clearance 0.152 mm
8 MCU_Ground: width 0.203 mm, drill 0.203 mm, clearance 0.152 mm to class 0, clearance 0.152 mm to class 1, clearance 0.152 mm to class 2, clearance 0.152 mm to class 3, clearance 0.152 mm to class 4, clearance 0.152 mm to class 5, clearance 0.152 mm to class 6, clearance 0.152 mm to class 7, clearance 0.152 mm

## Board
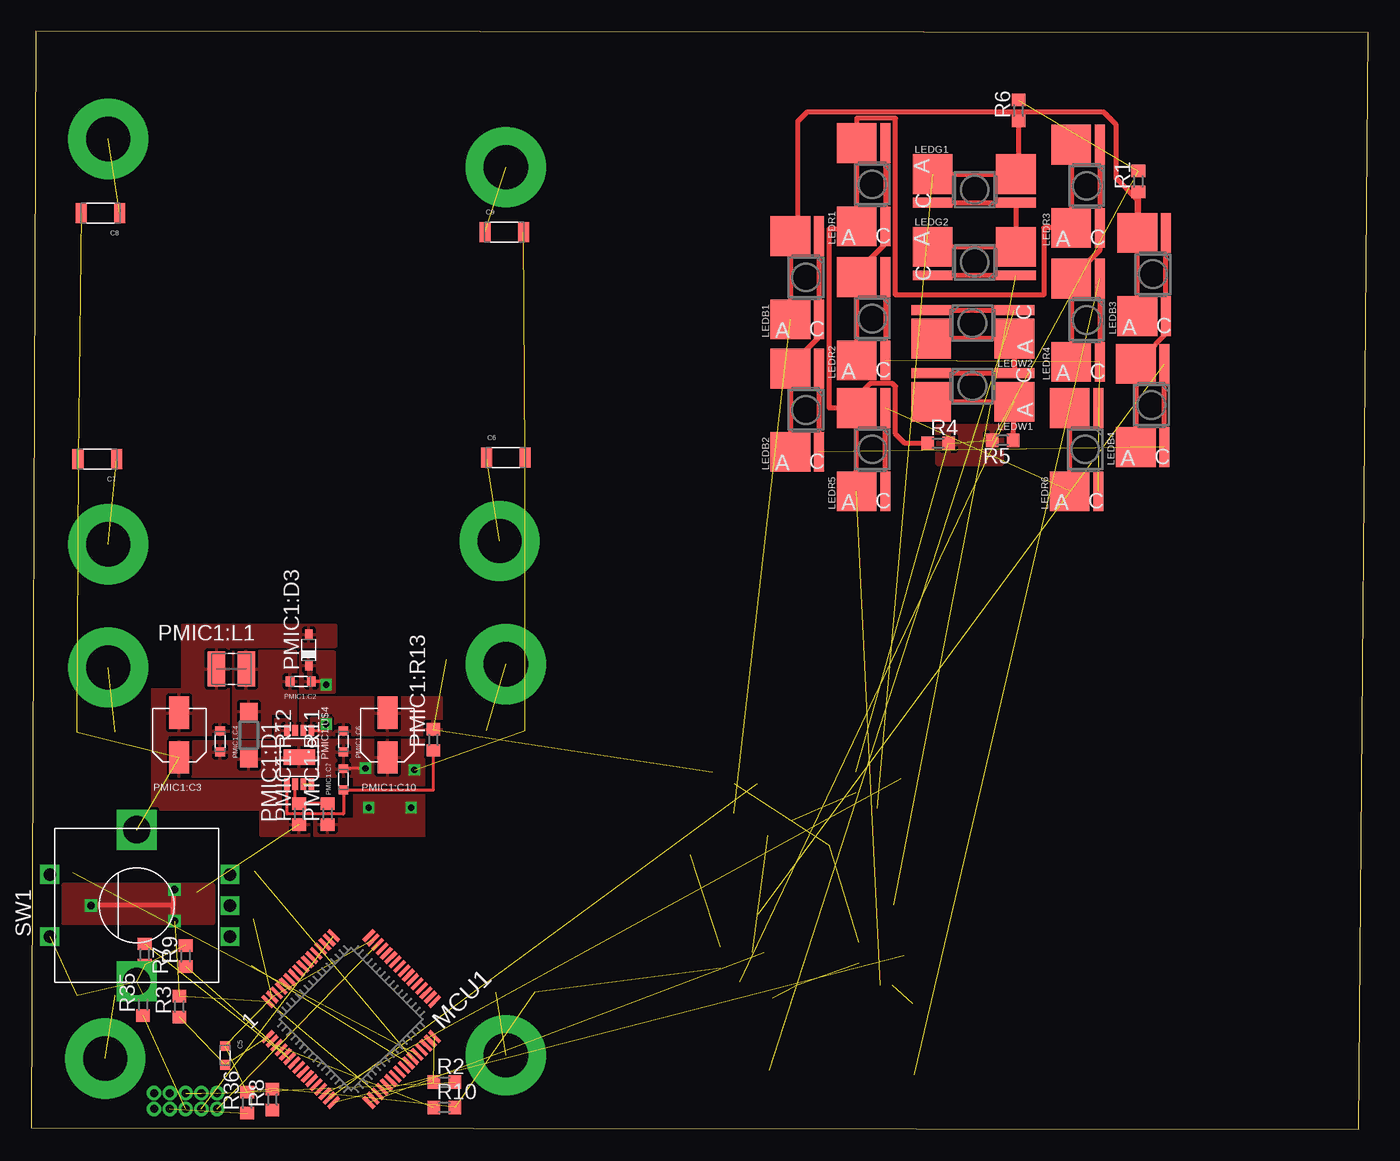
[diagram p5: board, top side]
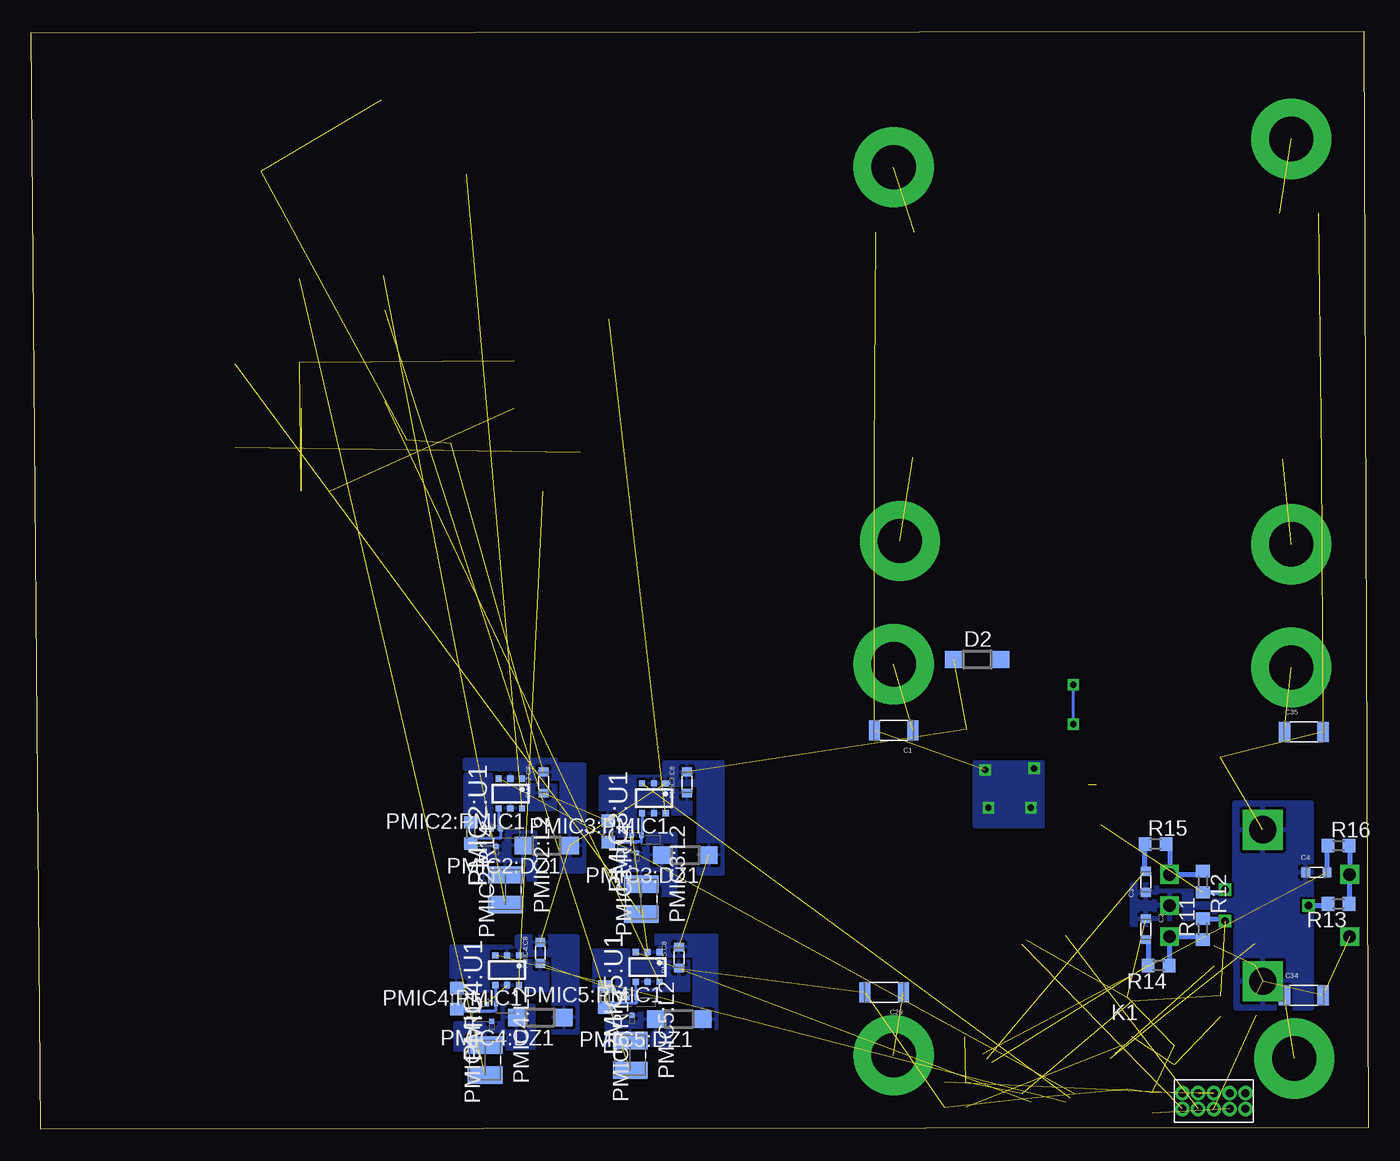
[diagram p6: board, bottom side, seen from below]

Size 107.68 x 88.44 mm. Coordinates in mm from the lower left corner, seen from the top.
Outline: 0,0.13 106.91,0 107.68,88.32 0.38,88.44 0,0.13
Copper layers (1*16): Top 0.035mm / dielectric 1.5mm / Bottom 0.035mm
Design rules "default": minimum track width 10mil, minimum drill 24mil, track to track 8mil, track to pad 8mil, pad to pad 8mil, via to via 8mil, smd to smd 8mil, copper to edge 40mil, drill to drill 8mil, minimum pad ring 10mil, minimum via ring 8mil, stop-mask expansion 4mil, vias tented up to drill 0mil, thermal gap 10mil

### Footprints (pad centres in the part's own frame; a part is rotated, then mirrored left to right if it is on the bottom)
WCAP-CSGP_1206 = smd 0.9 x 1.6: 1 -1.55,0; 2 1.55,0
WCAP-CSGP_0603_WAVE = smd 0.7 x 0.8: 1 -0.85,0; 2 0.85,0
WCAP-CSGP_0603_REFLOW = smd 0.8 x 0.8: 1 -0.75,0; 2 0.75,0
SOD123 = smd 1.4 x 1.4: A 1.9,0; C -1.9,0
62201021121 = drill 0.65: 1 -2.54,0.635; 2 -1.27,0.635; 3 0,0.635; 4 1.27,0.635; 5 2.54,0.635; 6 2.54,-0.635; 7 1.27,-0.635; 8 0,-0.635; 9 -1.27,-0.635; 10 -2.54,-0.635
P-LCC-2 = smd 3.2 x 3.2: 1 -3.35,1.6; 2 3.35,1.6 | smd 3.2 x 0.8: 3 -3.35,-0.7; 4 3.35,-0.7
LQFP64 = smd 1.2 x 0.3: 1 -5.75,3.75; 2 -5.75,3.25; 3 -5.75,2.75; 4 -5.75,2.25; 5 -5.75,1.75; 6 -5.75,1.25; 7 -5.75,0.75; 8 -5.75,0.25; 9 -5.75,-0.25; 10 -5.75,-0.75; 11 -5.75,-1.25; 12 -5.75,-1.75; 13 -5.75,-2.25; 14 -5.75,-2.75; 15 -5.75,-3.25; 16 -5.75,-3.75; 33 5.75,-3.75; 34 5.75,-3.25; 35 5.75,-2.75; 36 5.75,-2.25; 37 5.75,-1.75; 38 5.75,-1.25; 39 5.75,-0.75; 40 5.75,-0.25; 41 5.75,0.25; 42 5.75,0.75; 43 5.75,1.25; 44 5.75,1.75; 45 5.75,2.25; 46 5.75,2.75; 47 5.75,3.25; 48 5.75,3.75 | smd 0.3 x 1.2: 17 -3.75,-5.75; 18 -3.25,-5.75; 19 -2.75,-5.75; 20 -2.25,-5.75; 21 -1.75,-5.75; 22 -1.25,-5.75; 23 -0.75,-5.75; 24 -0.25,-5.75; 25 0.25,-5.75; 26 0.75,-5.75; 27 1.25,-5.75; 28 1.75,-5.75; 29 2.25,-5.75; 30 2.75,-5.75; 31 3.25,-5.75; 32 3.75,-5.75; 49 3.75,5.75; 50 3.25,5.75; 51 2.75,5.75; 52 2.25,5.75; 53 1.75,5.75; 54 1.25,5.75; 55 0.75,5.75; 56 0.25,5.75; 57 -0.25,5.75; 58 -0.75,5.75; 59 -1.25,5.75; 60 -1.75,5.75; 61 -2.25,5.75; 62 -2.75,5.75; 63 -3.25,5.75; 64 -3.75,5.75
2.6X1.6X1(BXCXA) = smd 2.6 x 1.6: 1 1.8,0; 2 -1.8,0
SOD323 = smd 0.8 x 0.6: A 1.25,0; C -1.25,0
WE-LQ_M = smd 1.4 x 2.8: 1 -1.2,0; 2 1.2,0
R0603 = smd 1 x 1.1: 1 -0.85,0; 2 0.85,0
MSOP8 = smd 0.45 x 0.9: 1 -0.975,-2.171; 2 -0.325,-2.171; 3 0.325,-2.171; 4 0.975,-2.171; 5 0.975,2.171; 6 0.325,2.171; 7 -0.325,2.171; 8 -0.975,2.171 | smd 2.54 x 1.27: 9 0,0
SC74_INFINEON = smd 0.5 x 0.5: 1 -0.95,-1.2; 2 0,-1.2; 3 0.95,-1.2; 4 0.95,1.2; 5 0,1.2; 6 -0.95,1.2
DFN1010D-3 = smd 0.35 x 0.4: 1 0.375,0.7; 2 -0.375,0.7 | smd 0.4 x 0.4: 3 0,-0.7
ALPS_EC11D = drill 1 square: A -2.5,-7.5; B 2.5,-7.5; C 0,-7.5; D -2.5,7; E 2.5,7 | drill 2.2 square: GND1 -6.1,0; GND2 6.1,0
PCB_MOUNTING_HOLES_M3 = drill 3.556 pad 6.452: PIN1 0,0

### Placement (x,y rotation side)
C1  38.23,32.13 180 bottom
C2  17.91,16.13 270 bottom
C3  17.91,19.94 90 bottom
C4  4.19,20.7 0 bottom
C5  15.62,5.97 270 top
C6  38.23,54.1 0 top
C7  5.33,53.98 180 top
C8  5.59,73.79 180 top
C9  38.1,72.26 0 top
C29  38.99,11.05 180 bottom
C34  5.21,10.79 0 bottom
C35  5.21,32 0 bottom
D2  31.5,37.85 0 bottom
K1  12.45,2.29 0 bottom
LEDB1  62.74,68.58 90 top
LEDB2  62.74,57.91 90 top
LEDB3  90.68,68.83 90 top
LEDB4  90.55,58.29 90 top
LEDG1  75.95,75.31 0 top
LEDG2  75.95,69.47 0 top
LEDR1  68.07,76.07 90 top
LEDR2  68.07,65.28 90 top
LEDR3  85.34,75.95 90 top
LEDR4  85.34,65.15 90 top
LEDR5  68.07,54.74 90 top
LEDR6  85.22,54.74 90 top
LEDW1  75.82,60.2 180 top
LEDW2  75.82,65.28 180 top
MCU1  25.78,8.89 45 top
PMIC1:C2  220pF  [WCAP-CSGP_0603_WAVE]  21.72,36.07 180 top
PMIC1:C3  45uF  [2.6X1.6X1(BXCXA)]  11.94,31.75 270 top
PMIC1:C4  4.7uF  [WCAP-CSGP_0603_WAVE]  15.24,31.24 270 top
PMIC1:C6  4.7uF  [WCAP-CSGP_0603_WAVE]  25.15,31.24 270 top
PMIC1:C7  4.7uF  [WCAP-CSGP_0603_WAVE]  25.15,28.19 90 top
PMIC1:C10  10uF  [2.6X1.6X1(BXCXA)]  28.7,31.75 270 top
PMIC1:D1  MBR0540T1  [SOD123]  17.53,31.75 270 top
PMIC1:D3  1N4148WS  [SOD323]  22.35,38.61 90 top
PMIC1:L1  1uH  [WE-LQ_M]  16.13,37.08 180 top
PMIC1:R11  10K  [R0603]  23.88,25.4 90 top
PMIC1:R12  17K5  [R0603]  21.59,25.4 90 top
PMIC1:R13  27K  [R0603]  32.38,31.37 90 top
PMIC1:U$4  LT1936  [MSOP8]  21.59,29.97 180 top
PMIC2:C8  [WCAP-CSGP_0603_WAVE]  66.42,27.94 90 bottom
PMIC2:DZ1  MBR0540T1  [SOD123]  66.17,22.86 180 bottom
PMIC2:L2  68uH  [WE-LQ_M]  69.47,19.3 90 bottom
PMIC2:PMIC1  ILD4001  [SC74_INFINEON]  69.09,27.05 180 bottom
PMIC2:R14  [R0603]  72.26,23.88 270 bottom
PMIC2:U1  PMXB56EN  [DFN1010D-3]  70.23,23.49 0 bottom
PMIC3:C8  [WCAP-CSGP_0603_WAVE]  54.86,27.94 90 bottom
PMIC3:DZ1  MBR0540T1  [SOD123]  54.99,22.1 180 bottom
PMIC3:L2  68uH  [WE-LQ_M]  58.55,18.54 90 bottom
PMIC3:PMIC1  ILD4001  [SC74_INFINEON]  57.53,26.67 180 bottom
PMIC3:R14  [R0603]  61.21,24 270 bottom
PMIC3:U1  PMXB56EN  [DFN1010D-3]  58.93,22.99 0 bottom
PMIC4:C8  [WCAP-CSGP_0603_WAVE]  66.67,14.22 90 bottom
PMIC4:DZ1  MBR0540T1  [SOD123]  66.67,9.02 180 bottom
PMIC4:L2  68uH  [WE-LQ_M]  71.12,5.59 90 bottom
PMIC4:PMIC1  ILD4001  [SC74_INFINEON]  69.34,12.83 180 bottom
PMIC4:R14  [R0603]  73.41,10.54 270 bottom
PMIC4:U1  PMXB56EN  [DFN1010D-3]  70.61,9.4 0 bottom
PMIC5:C8  [WCAP-CSGP_0603_WAVE]  55.5,13.84 90 bottom
PMIC5:DZ1  MBR0540T1  [SOD123]  55.5,8.89 180 bottom
PMIC5:L2  68uH  [WE-LQ_M]  59.44,5.97 90 bottom
PMIC5:PMIC1  ILD4001  [SC74_INFINEON]  58.04,13.08 180 bottom
PMIC5:R14  [R0603]  61.47,10.67 270 bottom
PMIC5:U1  PMXB56EN  [DFN1010D-3]  59.31,9.91 0 bottom
R1  89.15,76.33 90 top
R2  33.27,3.81 0 top
R3  11.94,9.91 90 top
R4  73.03,55.25 0 top
R5  78.23,55.5 180 top
R6  79.5,82.04 90 top
R7  9.14,14.1 270 top
R8  19.43,2.41 90 top
R9  12.45,13.97 90 top
R10  33.27,1.78 0 top
R11  13.34,16.13 90 bottom
R12  13.34,19.94 270 bottom
R13  2.41,18.16 180 bottom
R14  16.89,13.21 180 bottom
R15  17.14,22.99 0 bottom
R16  2.41,22.86 0 bottom
R35  9.02,10.03 90 top
R36  17.4,2.16 90 top
SW1  8.51,18.03 90 top
U$1  6.22,47.12 0 top
U$2  37.72,47.37 0 top
U$3  6.22,79.76 0 top
U$4  38.23,77.47 0 top
U$8  38.23,37.47 0 top
U$10  5.97,5.71 0 top
U$11  38.23,5.97 0 top
U$15  6.22,37.21 0 top

### Tracks (layer width: path | path; a pad name or v marks a point on that pad's centre or on a via)
DRIVER_LEDB  (2 unrouted)
  Top 0.406: LEDB4.3 LEDB4.4 | LEDB2.4 LEDB2.3
DRIVER_LEDG  (1 unrouted)
  Top 0.406: LEDG2.4 LEDG2.3
DRIVER_LEDR  (4 unrouted)
  Top 0.406: LEDR4.4 LEDR4.3 | LEDR2.4 LEDR2.3
DRIVER_LEDW  (1 unrouted)
  Top 0.406: LEDW2.4 LEDW2.3
ENCODER_A  (1 unrouted)
  Bottom 0.406: C2.2 17.74,15.28 R14.2
ENCODER_B  (1 unrouted)
  Bottom 0.406: C3.2 18,20.79 R15.1
ENCODER_D  (1 unrouted)
  Bottom 0.406: R16.1 3.34,22.86 C4.2
GND_MCU  (via drill 0.5)  (28 unrouted)
  Top 0.254: 26.42,29.08 25.15,29.08 PMIC1:C7.2
  other vias: 27.18,25.91 30.61,25.91 30.86,28.96 26.92,29.08
  pour Top: 11.3,31.24 19.68,31.24 19.68,33.02 20.7,33.02 20.7,31.37 31.62,31.37 31.62,28.45 11.3,28.45
  pour Top: 22.86,25.02 26.04,25.02 26.04,28.7 31.62,28.7 31.62,23.62 22.86,23.62
  pour Bottom: 26.16,29.59 31.75,29.59 31.75,24.38 26.16,24.38
  pour Bottom: 65.41,27.69 68.71,27.81 68.71,28.57 72.77,28.57 72.77,24.13 70.48,24.13 70.48,25.78 65.41,25.78
  pour Bottom: 54.48,27.3 57.02,27.3 57.02,28.45 61.85,28.45 61.85,23.62 58.93,23.62 58.93,25.4 54.48,25.4
  pour Bottom: 66.04,13.59 68.96,13.59 68.96,14.73 73.91,14.73 73.91,11.18 66.04,11.18
  pour Bottom: 54.74,11.18 62.36,11.18 62.36,14.48 57.66,14.48 57.66,13.59 54.74,13.59
  pour Bottom: 19.05,19.68 19.05,16.51 17.14,16.51 17.14,17.02 10.67,17.02 10.67,9.78 4.57,9.78 4.57,26.29 10.79,26.29 10.79,19.18 17.02,19.18 17.02,19.68
LEDB  (1 unrouted)
LEDG  (1 unrouted)
LEDR  (1 unrouted)
LEDW  (1 unrouted)
N$1
  Bottom 0.406: R14.1 16.04,15.53 SW1.A 13.59,15.53 R11.1
N$2
  Bottom 0.406: R15.2 16.01,22.99 SW1.B 13.46,20.53 R12.1
N$3
  Top 0.406: LEDG1.3 LEDG1.4 LEDG2.2 LEDG2.1
N$4
  Top 0.406: LEDB1.4 LEDB1.3 63.44,63.82 61.98,62.36 61.98,62.1 LEDB2.2 LEDB2.1
N$5  (1 unrouted)
N$6
  Top 0.406: LEDB3.4 LEDB3.3 91.38,64.07 89.66,62.36 89.66,62.35 LEDB4.2 LEDB4.1
N$7
  Top 0.406: LEDR1.4 LEDR1.3 68.77,71.31 66.8,69.34 66.8,68.96 LEDR2.2 LEDR2.1
N$8  (1 unrouted)
N$9  (1 unrouted)
N$10  (1 unrouted)
N$11  (1 unrouted)
N$12
  Top 0.406: LEDR3.4 LEDR3.3 86.04,70.8 LEDR4.2 LEDR4.1
N$14  (1 unrouted)
  Top 0.406: LEDR6.1 LEDR6.2 | LEDR5.3 LEDR5.4
N$15  (1 unrouted)
N$16
  Bottom 0.406: R16.2 1.51,22.86 SW1.E 1.51,18.29 R13.1
N$17  (1 unrouted)
N$18  (1 unrouted)
N$19  (2 unrouted)
N$20  (1 unrouted)
N$25
  Top 0.406: LEDW2.2 LEDW2.1 LEDW1.3 LEDW1.4
N$26  (1 unrouted)
N$27  (1 unrouted)
PMIC1:N$28  (1 unrouted)
PMIC1:N$30
  Top 0.254: PMIC1:U$4.5 20.61,25.4 25.15,25.4 PMIC1:C7.1 25.15,27.3 32.38,27.3 PMIC1:R13.1
PMIC1:N$35
  Top 0.254: PMIC1:R11.2 PMIC1:R12.2 21.27,26.25 PMIC1:U$4.6
PMIC1:PMIC_LT1936_BOOST  (via drill 0.5)
  Top 0.254: PMIC1:U$4.1 23.5,32.14 v23.75,32.64 | v23.75,35.81 23.5,36.07 PMIC1:C2.1
  Bottom 0.254: v23.75,32.64 v23.75,35.81
  pour Top: 21.72,38.48 24.38,38.48 24.38,35.18 21.72,35.18
  pour Top: 22.61,31.75 22.61,33.15 24.13,33.15 24.13,31.75
PMIC1:PMIC_LT1936_SW
  pour Top: 21.34,32 21.34,38.48 16.26,38.48 16.26,31.62 19.3,31.62 19.3,33.53 21.08,33.53 21.08,32
PMIC2:N$2
  Bottom 0.254: PMIC2:PMIC1.4 70.04,24.2 PMIC2:U1.1 69.85,23.49 72.26,23.49 PMIC2:R14.2
PMIC2:N$29
  pour Bottom: 67.06,24 67.06,20.07 71.25,20.07 71.25,23.11 69.47,23.11 69.47,24
PMIC3:N$2
  Bottom 0.254: PMIC3:PMIC1.4 58.48,23.69 PMIC3:U1.1 58.55,23.15 PMIC3:R14.2
PMIC3:N$29
  pour Bottom: 55.75,23.88 55.75,18.8 60.2,18.8 60.2,22.73 58.04,22.73 58.04,23.88
PMIC4:N$2
  Bottom 0.254: PMIC4:R14.2 72.9,9.69 72.9,9.53 70.29,9.53 70.29,10.1 | PMIC4:PMIC1.4 70.29,10.1 | 70.29,10.1 PMIC4:U1.1
PMIC4:N$29
  pour Bottom: 67.18,10.03 67.18,6.48 73.53,6.35 73.53,8.64 69.72,8.64 69.72,10.03
PMIC5:N$2
  Bottom 0.254: PMIC5:PMIC1.4 58.99,10.61 PMIC5:U1.1 58.93,10.16 61.09,10.16 61.09,9.82 PMIC5:R14.2
PMIC5:N$29
  pour Bottom: 56.26,9.4 56.26,6.73 61.34,6.73 61.34,8.76 59.69,8.76 59.69,9.4
S3V3_MCU_VDD  (via drill 0.6)  (6 unrouted)
  Top 0.406: v11.56,16.76 11.43,16.76 11.43,18.03 | 11.43,18.03 v4.83,18.03 | v11.56,19.3 11.43,19.3 11.43,18.03
  Bottom 0.406: R11.2 11.56,16.98 v11.56,16.76 | v4.83,18.03 3.26,18.03 R13.2 | R12.2 11.56,19.09 v11.56,19.3
  pour Top: 24.51,38.86 15.88,38.86 15.88,31.75 12.19,31.75 12.19,40.64 24.51,40.64
  pour Top: 9.78,35.43 12.7,35.43 12.7,31.75 10.92,31.75 10.92,28.07 20.07,28.07 20.07,25.02 22.35,25.02 22.35,23.62 18.54,23.62 18.54,25.78 9.78,25.78
  pour Top: 14.61,16.64 2.67,16.64 2.67,19.68 14.61,19.68
SUPPLY_24V  (9 unrouted)
  pour Bottom: 56.77,27.69 53.98,27.69 53.98,20.57 51.94,20.57 51.94,29.59 56.77,29.59
  pour Top: 33.02,31.75 24.38,31.75 24.38,33.53 22.1,33.53 22.1,32 21.72,32 21.72,34.8 33.02,34.8
  pour Bottom: 68.33,28.19 68.33,29.46 63.12,29.46 63.12,20.7 65.02,20.7 65.02,28.19
  pour Bottom: 65.66,13.97 68.58,13.97 68.58,15.62 63.63,15.62 63.63,7.75 65.66,7.75
  pour Bottom: 54.36,13.97 54.36,8.13 52.45,8.13 52.45,15.62 57.4,15.62 57.4,13.97
  pour Bottom: 65.41,28.96 72.77,28.96 72.77,29.84 65.41,29.84
  pour Top: 73.03,56.64 78.11,56.64 78.11,53.59 73.03,53.59
SWCLK  (1 unrouted)
SWDIO  (1 unrouted)
SWO  (1 unrouted)
TDI  (1 unrouted)
VSENSE_LEDB  (1 unrouted)
  Top 0.406: LEDB3.1 LEDB3.2 | R1.1 89.15,72.26 LEDB3.2 | LEDB3.2 89.08,74.88 87.38,76.58 87.38,80.9 86.36,81.91 62.48,81.91 61.72,81.15 61.72,72.51 LEDB1.2 LEDB1.1
VSENSE_LEDG  (1 unrouted)
  Top 0.406: LEDG1.1 LEDG1.2 79.5,77.12 R6.1
VSENSE_LEDR  (1 unrouted)
  Top 0.406: LEDR3.2 LEDR3.1 81.53,72.6 81.53,67.18 69.6,67.18 69.6,81.41 66.47,81.41 LEDR1.2 LEDR1.1 | LEDR1.1 66.47,72.47 66.67,72.26 66.67,72.52 LEDR1.1 | LEDR5.1 LEDR5.2 | LEDR5.2 64.26,58.09 64.26,72.52 66.47,72.52 LEDR1.1 | R4.1 70.36,55.25 69.6,56.01 69.6,59.82 69.34,60.07 67.56,60.07 66.29,58.8 66.29,58.27 LEDR5.2
VSENSE_LEDW  (1 unrouted)
  Top 0.406: LEDW1.2 LEDW1.1 R5.1
VTREF  (1 unrouted)